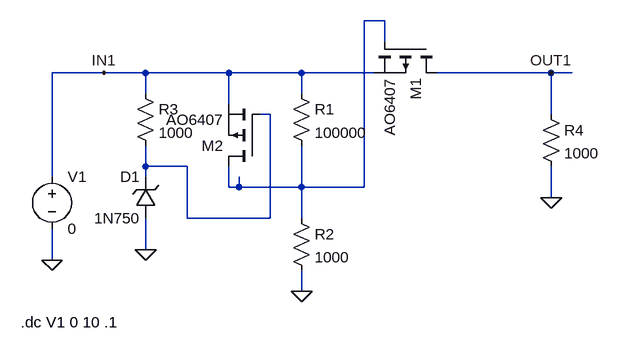
[diagram p0: schematic OVP.asc]
OVP.asc, the LTspice schematic file:
Version 4
SHEET 1 880 680
WIRE 384 -80 352 -80
WIRE 384 -48 384 -80
WIRE -48 0 -128 0
WIRE 16 0 -48 0
WIRE 144 0 16 0
WIRE 256 0 144 0
WIRE 368 0 256 0
WIRE 640 0 464 0
WIRE 672 0 640 0
WIRE 16 32 16 0
WIRE 256 32 256 0
WIRE 144 48 144 0
WIRE 208 64 192 64
WIRE 640 64 640 0
WIRE 16 144 16 112
WIRE 80 144 16 144
WIRE -128 160 -128 0
WIRE 16 160 16 144
WIRE 144 176 144 144
WIRE 160 176 160 160
WIRE 160 176 144 176
WIRE 256 176 256 112
WIRE 256 176 160 176
WIRE 352 176 352 -80
WIRE 352 176 256 176
WIRE 640 192 640 144
WIRE 80 224 80 144
WIRE 208 224 208 64
WIRE 208 224 80 224
WIRE 256 224 256 176
WIRE 16 272 16 224
WIRE -128 288 -128 240
WIRE 256 336 256 304
FLAG -128 288 0
FLAG 640 0 OUT1
FLAG 16 272 0
FLAG 256 336 0
FLAG 640 192 0
FLAG -48 0 IN1
SYMBOL voltage -128 144 R0
WINDOW 123 0 0 Left 2
WINDOW 39 0 0 Left 2
SYMATTR InstName V1
SYMATTR Value 0
SYMBOL pmos 464 -48 R90
SYMATTR InstName M1
SYMATTR Value AO6407
SYMBOL res 240 16 R0
SYMATTR InstName R1
SYMATTR Value 100000
SYMBOL res 240 208 R0
SYMATTR InstName R2
SYMATTR Value 1000
SYMBOL pmos 192 144 R180
SYMATTR InstName M2
SYMATTR Value AO6407
SYMBOL res 0 16 R0
SYMATTR InstName R3
SYMATTR Value 1000
SYMBOL zener 32 224 R180
WINDOW 0 24 64 Left 2
WINDOW 3 24 0 Left 2
SYMATTR InstName D1
SYMATTR Value 1N750
SYMBOL res 624 48 R0
SYMATTR InstName R4
SYMATTR Value 1000
TEXT -176 384 Left 2 !.dc V1 0 10 .1

The netlist it stands for:
* OVP.asc
V1 IN1 0 0
M1 OUT1 N001 IN1 IN1 AO6407
R1 IN1 N001 100000
R2 N001 0 1000
M2 N001 N002 IN1 IN1 AO6407
R3 IN1 N002 1000
D1 0 N002 1N750
R4 OUT1 0 1000
.model D D
.lib standard.dio
.model NMOS NMOS
.model PMOS PMOS
.lib standard.mos
.dc V1 0 10 .1
.backanno
.end